# EasyEDA Pro project 无刷电调_V3.1.epro, schematic 无刷电调_V3.1

## Sheets
1 P1: Board Name: 无刷电调_V3.1; Create Date: 2025-04-09; Page Name: P1; Project Name: BLDC电调; Schematic Name: 无刷电调_V3.1; Update Date: 2025-04-09; Company: 嘉立创EDA; Page Size: A4; Version: V1.0
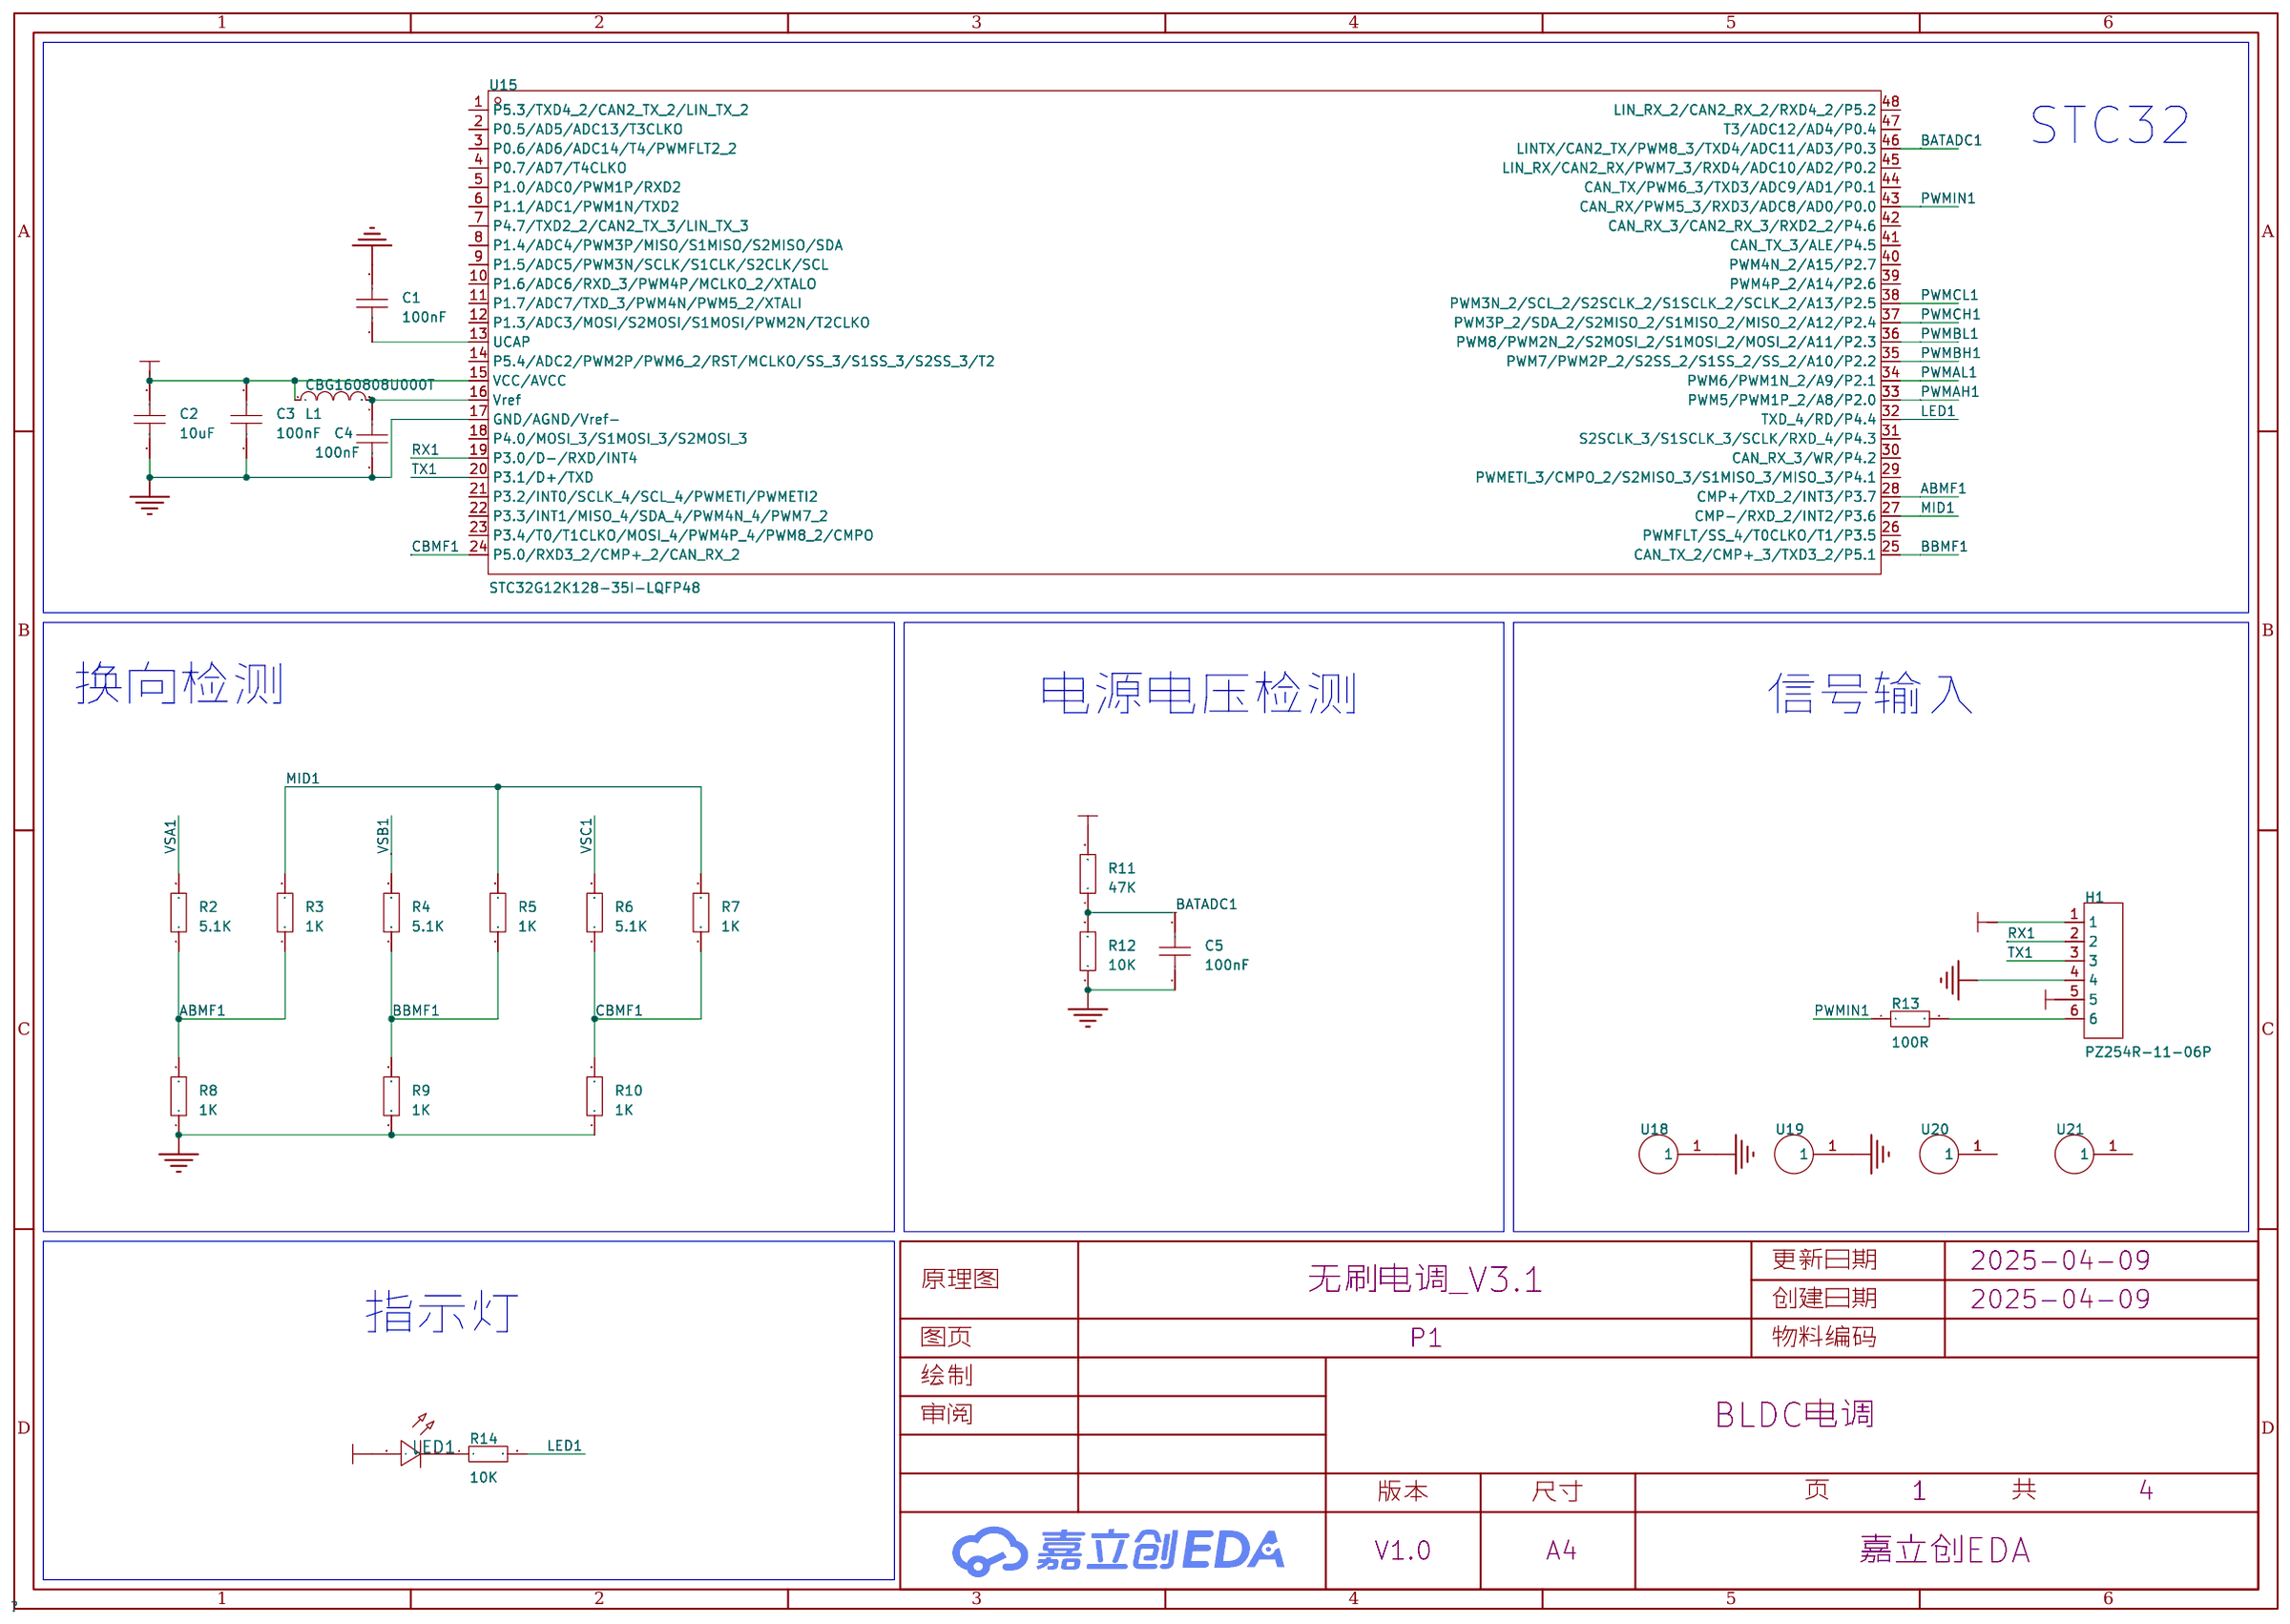
[diagram p0: P1]
2 P2: Page Name: P2
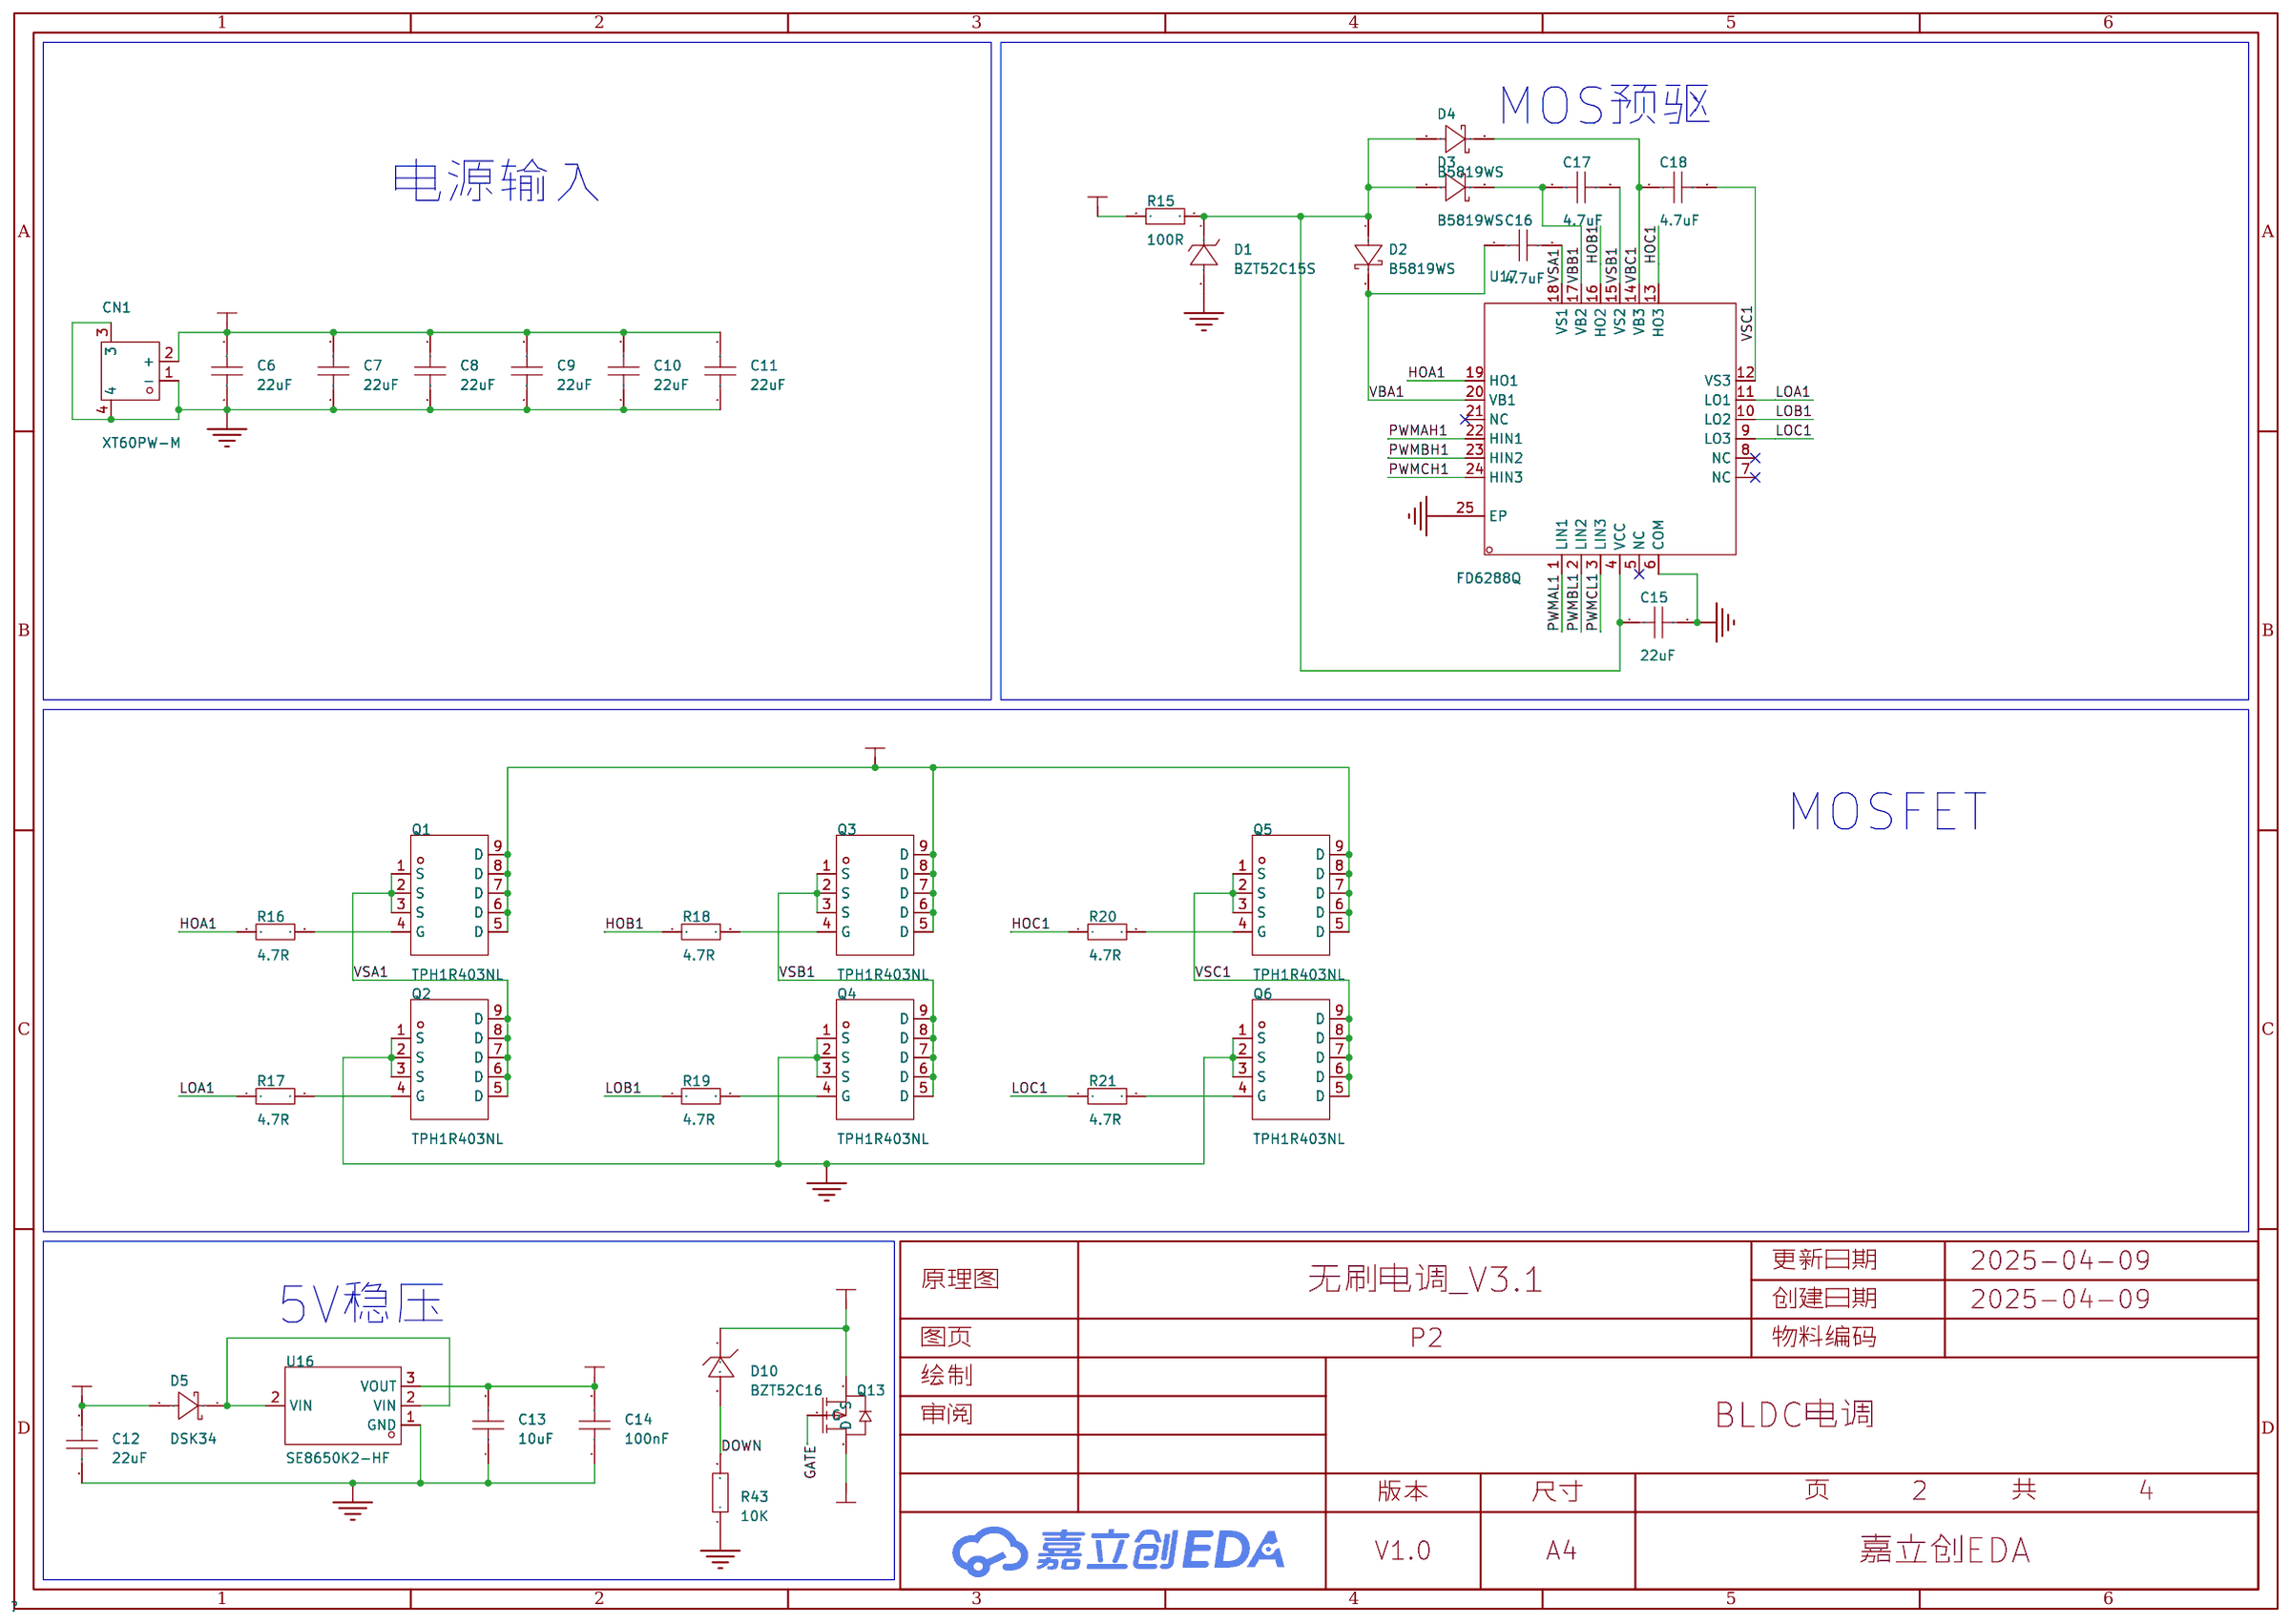
[diagram p1: P2]
3 P3: Board Name: 无刷电调_V3.0; Create Date: 2025-03-24; Page Name: P3; Schematic Name: 无刷电调_V3.0; Update Date: 2025-03-24
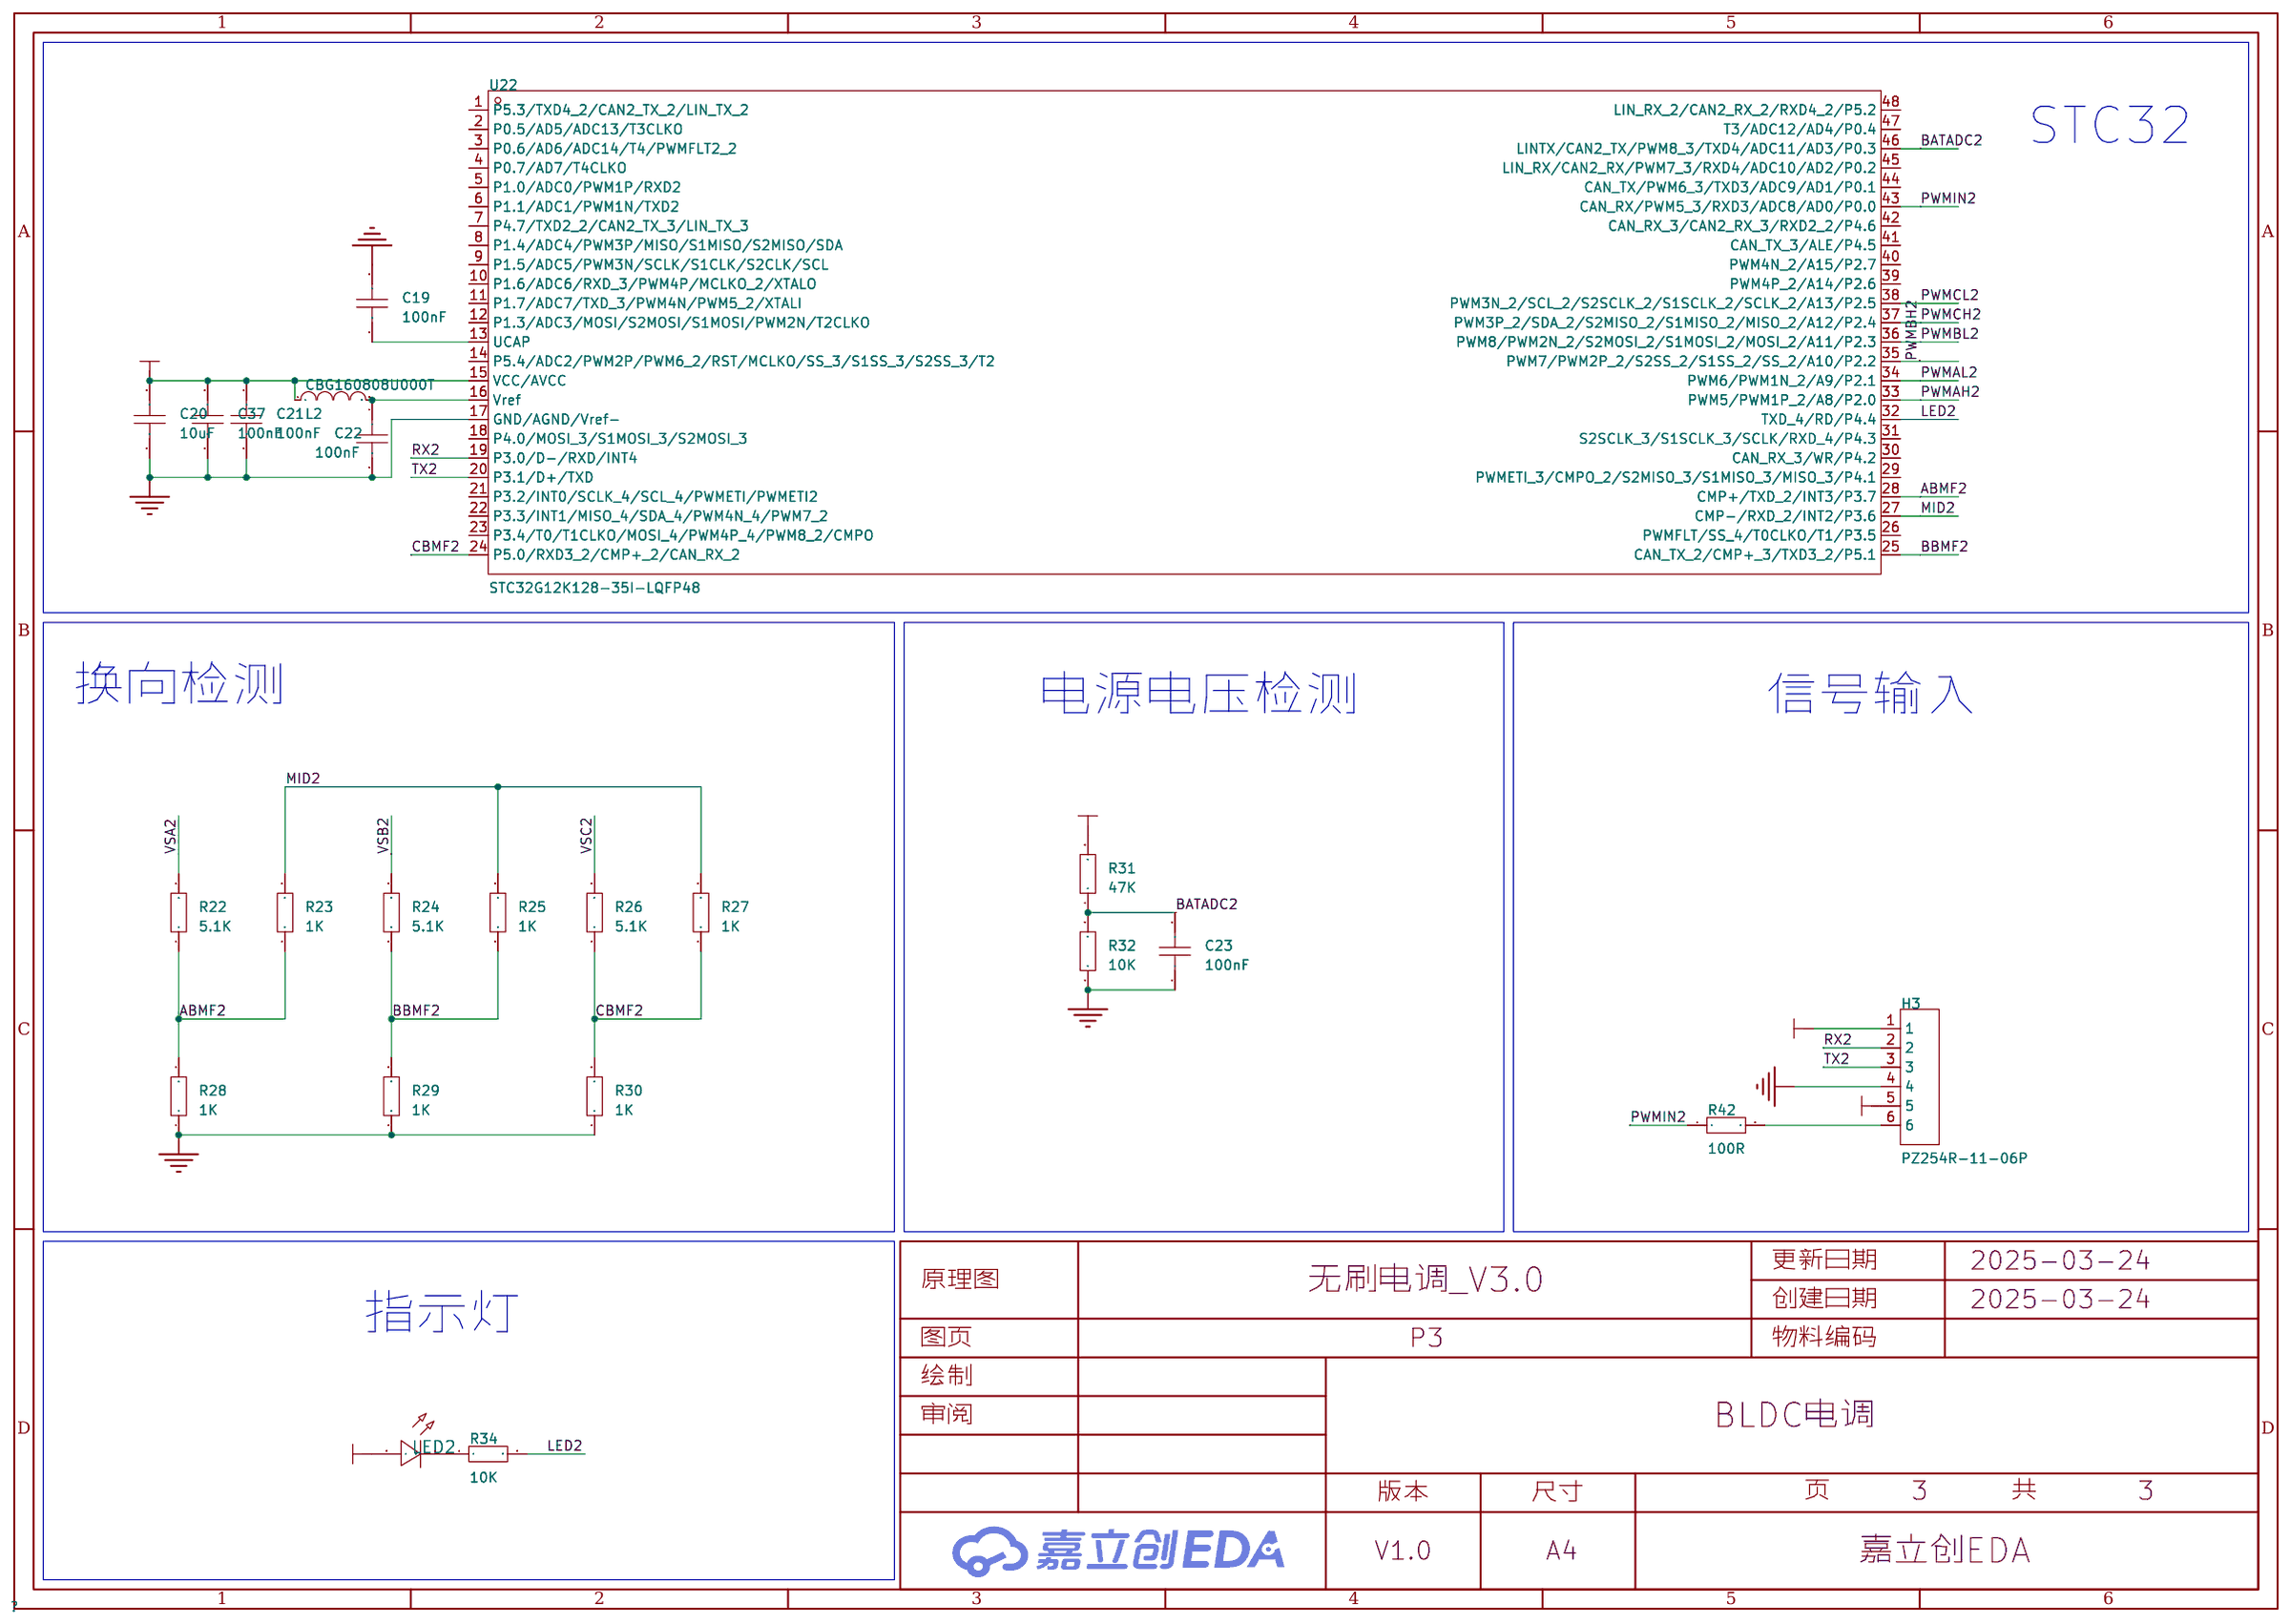
[diagram p2: P3]
4 P4: Board Name: 无刷电调_V3.0; Create Date: 2025-03-24; Page Name: P4; Schematic Name: 无刷电调_V3.0; Update Date: 2025-03-24
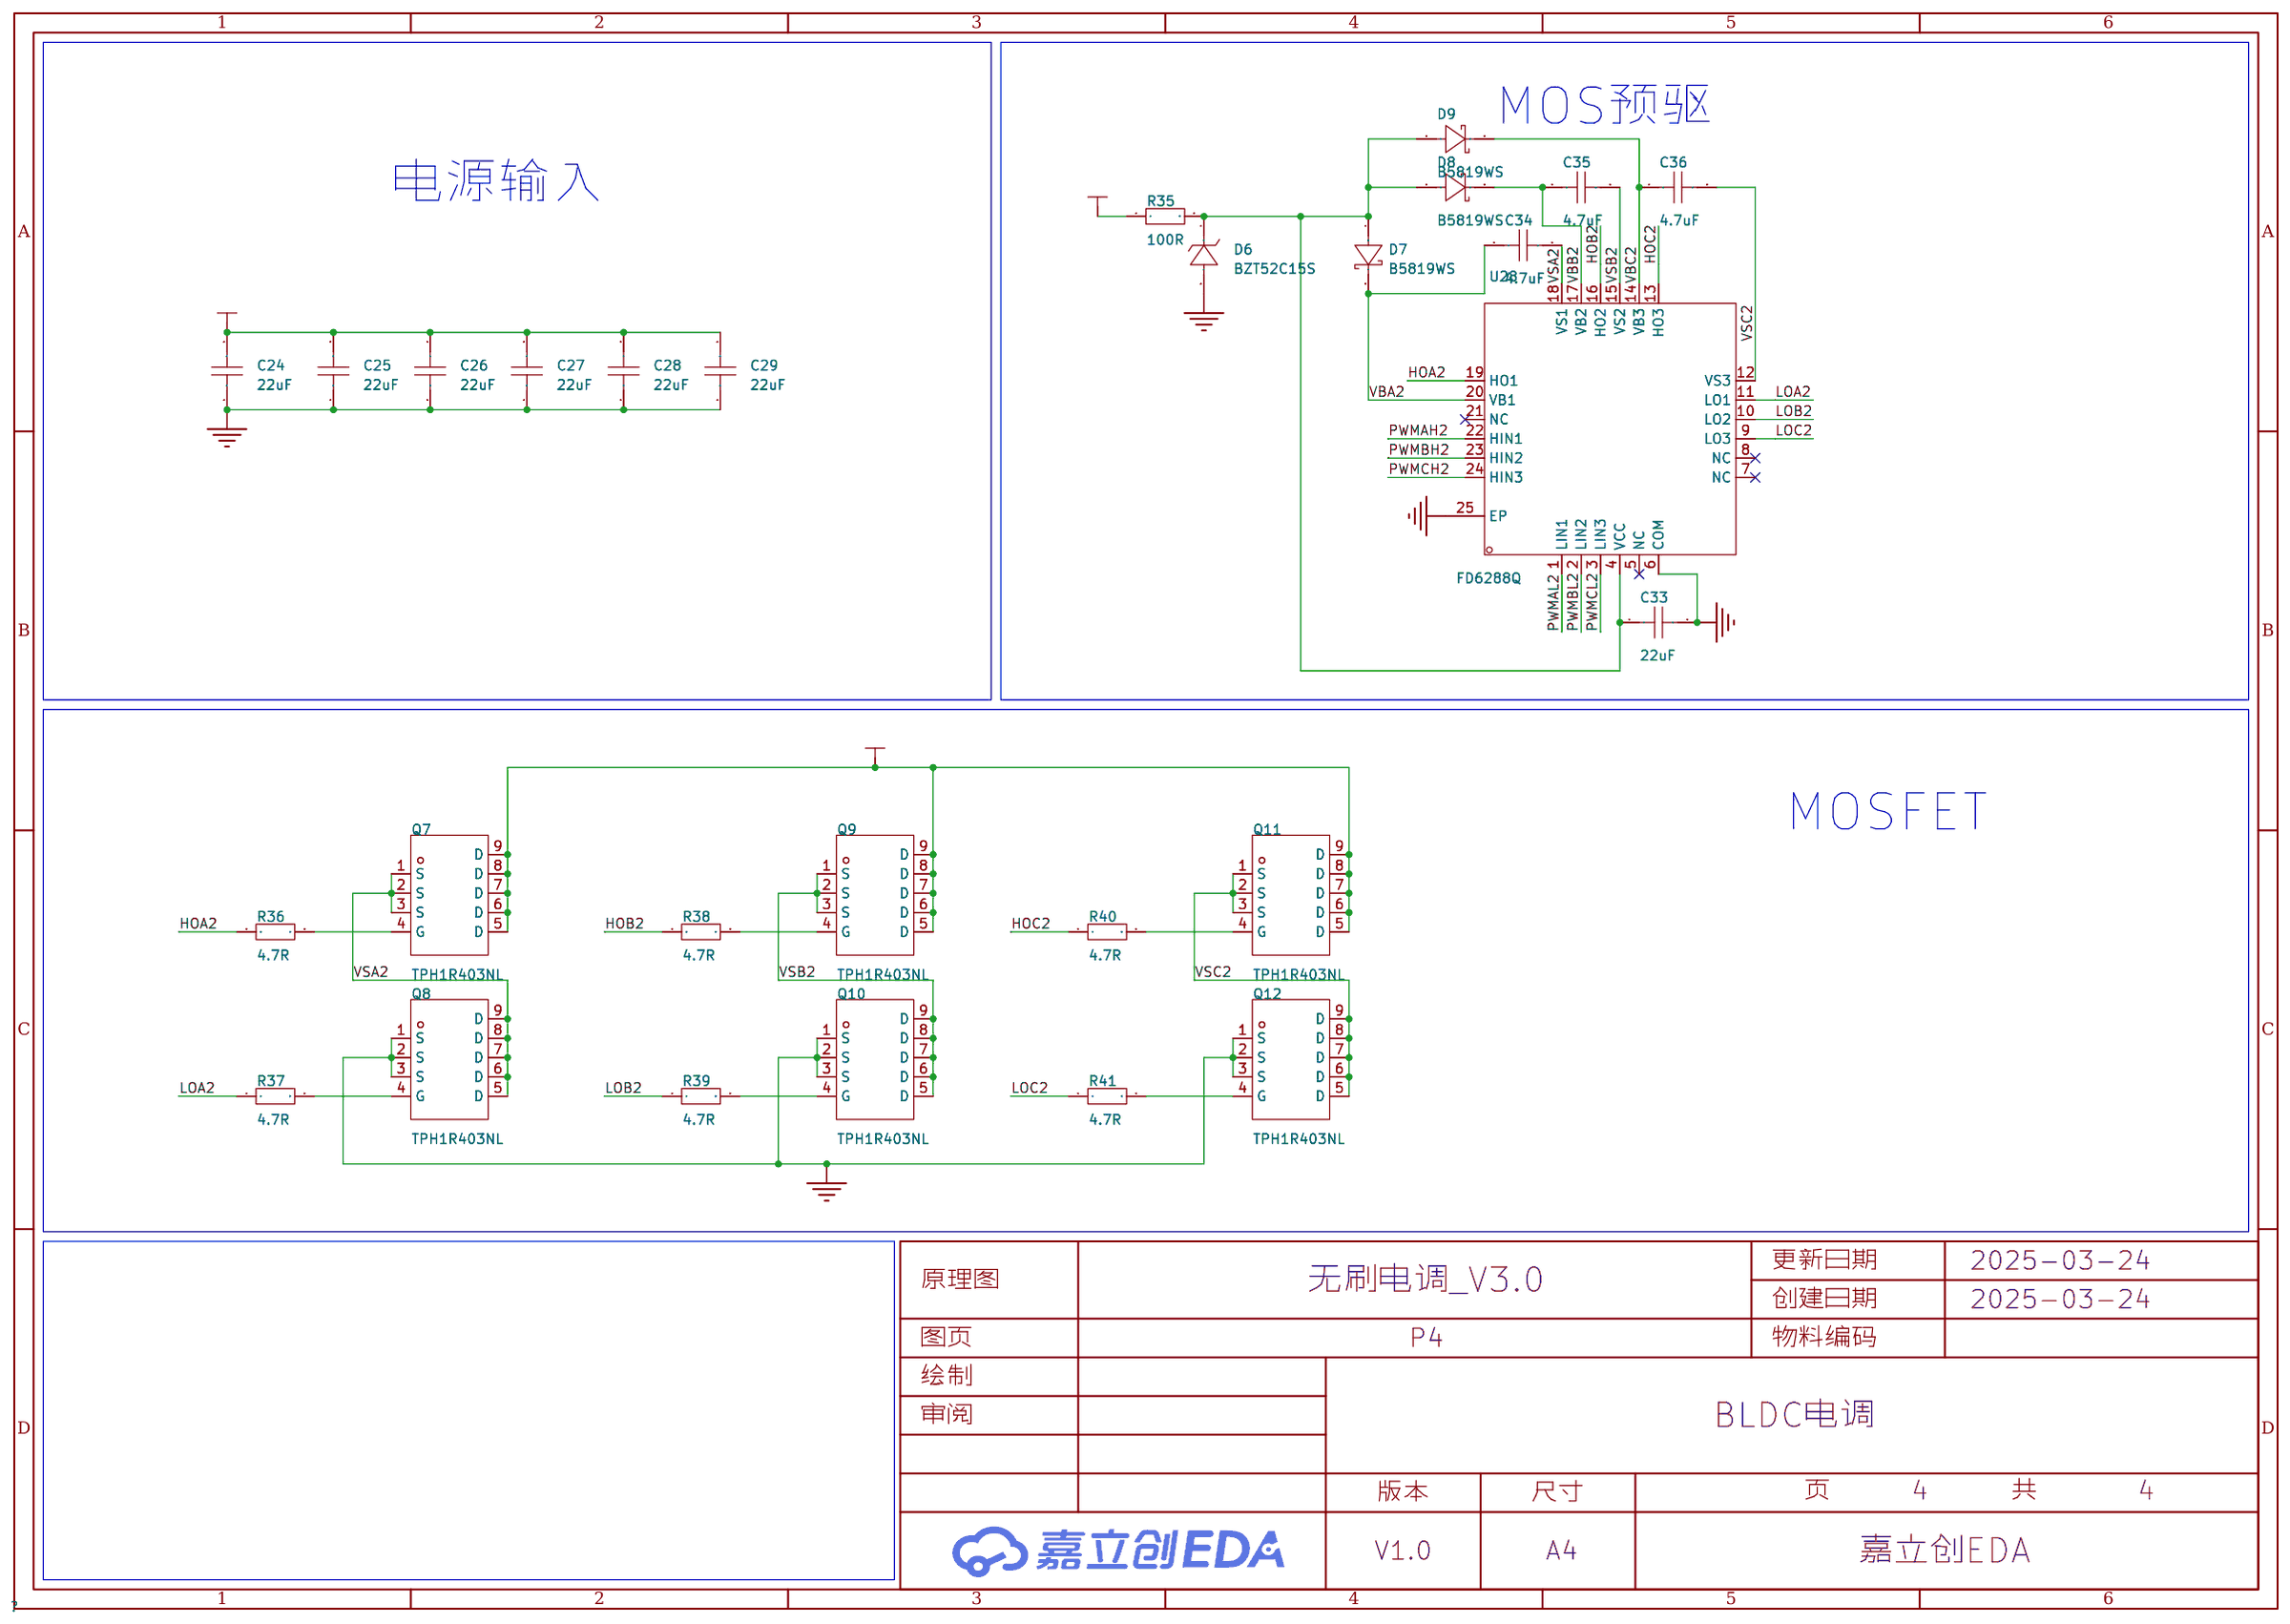
[diagram p3: P4]

## Parts
sheet P1
C1  100nF  [C0603]
C2  10uF  [C0603]
C3  100nF  [C0603]
C4  100nF  [C0603]
C5  100nF  [C0603]
H1  PZ254R-11-06P  [HDR-TH_6P-P2.54-H-M-W10.4]
L1  CBG160808U000T  [L0603]
LED1  -  [LED_0603]
R2  5.1K  [R0603]
R3  1K  [R0603]
R4  5.1K  [R0603]
R5  1K  [R0603]
R6  5.1K  [R0603]
R7  1K  [R0603]
R8  1K  [R0603]
R9  1K  [R0603]
R10  1K  [R0603]
R11  47K  [R0603]
R12  10K  [R0603]
R13  100R  [R0603]
R14  10K  [R0603]
U15  STC32G12K128-35I-LQFP48  [LQFP-48_L7.0-W7.0-P0.50-LS9.0-BL]
U18  -  [M3螺丝孔]  (no BOM)
U19  -  [M3螺丝孔]  (no BOM)
U20  -  [M3螺丝孔]  (no BOM)
U21  -  [M3螺丝孔]  (no BOM)
sheet P2
C6  22uF  [C0805]
C7  22uF  [C0805]
C8  22uF  [C0805]
C9  22uF  [C0805]
C10  22uF  [C0805]
C11  22uF  [C0805]
C12  22uF  [C0805]
C13  10uF  [C0603]
C14  100nF  [C0603]
C15  22uF  [C0805]
C16  4.7uF  [C0805]
C17  4.7uF  [C0805]
C18  4.7uF  [C0805]
CN1  XT60PW-M  [CONN-TH_XT60PW-M]
D1  BZT52C15S  [SOD-323_L1.7-W1.3-LS2.6-RD]
D2  B5819WS  [SOD-323_L1.7-W1.3-LS2.5-FD]
D3  B5819WS  [SOD-323_L1.7-W1.3-LS2.5-FD]
D4  B5819WS  [SOD-323_L1.7-W1.3-LS2.5-FD]
D5  DSK34  [SOD-123_L2.8-W1.8-LS3.7-RD]
D10  BZT52C16  [SOD-123_L2.7-W1.6-LS3.7-RD]
Q1  TPH1R403NL  [DSOP-8_L5.0-W5.0-P1.27-LS6.0-BL-EP]
Q2  TPH1R403NL  [DSOP-8_L5.0-W5.0-P1.27-LS6.0-BL-EP]
Q3  TPH1R403NL  [DSOP-8_L5.0-W5.0-P1.27-LS6.0-BL-EP]
Q4  TPH1R403NL  [DSOP-8_L5.0-W5.0-P1.27-LS6.0-BL-EP]
Q5  TPH1R403NL  [DSOP-8_L5.0-W5.0-P1.27-LS6.0-BL-EP]
Q6  TPH1R403NL  [DSOP-8_L5.0-W5.0-P1.27-LS6.0-BL-EP]
Q13  -  [AO3401A_SOT-23-3]
R15  100R  [R0603]
R16  4.7R  [R0603]
R17  4.7R  [R0603]
R18  4.7R  [R0603]
R19  4.7R  [R0603]
R20  4.7R  [R0603]
R21  4.7R  [R0603]
R43  10K  [R0603]
U16  SE8650K2-HF  [SOT-89-3_L4.5-W2.5-P1.50-LS4.2-BR]
U17  FD6288Q  [QFN-24_L4.0-W4.0-P0.50-BL-EP2.6]
sheet P3
C19  100nF  [C0603]
C20  10uF  [C0603]
C21  100nF  [C0603]
C22  100nF  [C0603]
C23  100nF  [C0603]
C37  100nF  [C0603]
H3  PZ254R-11-06P  [HDR-TH_6P-P2.54-H-M-W10.4]
L2  CBG160808U000T  [L0603]
LED2  -  [LED_0603]
R22  5.1K  [R0603]
R23  1K  [R0603]
R24  5.1K  [R0603]
R25  1K  [R0603]
R26  5.1K  [R0603]
R27  1K  [R0603]
R28  1K  [R0603]
R29  1K  [R0603]
R30  1K  [R0603]
R31  47K  [R0603]
R32  10K  [R0603]
R34  10K  [R0603]
R42  100R  [R0603]
U22  STC32G12K128-35I-LQFP48  [LQFP-48_L7.0-W7.0-P0.50-LS9.0-BL]
sheet P4
C24  22uF  [C0805]
C25  22uF  [C0805]
C26  22uF  [C0805]
C27  22uF  [C0805]
C28  22uF  [C0805]
C29  22uF  [C0805]
C33  22uF  [C0805]
C34  4.7uF  [C0805]
C35  4.7uF  [C0805]
C36  4.7uF  [C0805]
D6  BZT52C15S  [SOD-323_L1.7-W1.3-LS2.6-RD]
D7  B5819WS  [SOD-323_L1.7-W1.3-LS2.5-FD]
D8  B5819WS  [SOD-323_L1.7-W1.3-LS2.5-FD]
D9  B5819WS  [SOD-323_L1.7-W1.3-LS2.5-FD]
Q7  TPH1R403NL  [DSOP-8_L5.0-W5.0-P1.27-LS6.0-BL-EP]
Q8  TPH1R403NL  [DSOP-8_L5.0-W5.0-P1.27-LS6.0-BL-EP]
Q9  TPH1R403NL  [DSOP-8_L5.0-W5.0-P1.27-LS6.0-BL-EP]
Q10  TPH1R403NL  [DSOP-8_L5.0-W5.0-P1.27-LS6.0-BL-EP]
Q11  TPH1R403NL  [DSOP-8_L5.0-W5.0-P1.27-LS6.0-BL-EP]
Q12  TPH1R403NL  [DSOP-8_L5.0-W5.0-P1.27-LS6.0-BL-EP]
R35  100R  [R0603]
R36  4.7R  [R0603]
R37  4.7R  [R0603]
R38  4.7R  [R0603]
R39  4.7R  [R0603]
R40  4.7R  [R0603]
R41  4.7R  [R0603]
U28  FD6288Q  [QFN-24_L4.0-W4.0-P0.50-BL-EP2.6]

## Library data of the parts
C1-C5 C13 C14 C19-C23 C37 = CAP_0603: Supplier Footprint: 0603
H1 H3 = PZ254R-11-06P: 插针结构:1x6P;间距:2.54mm;行距:-;圆针/方针:方针;安装方式:弯插;排数:单排;总PIN位数:6P;额定电流:-;额定电压:-;配合针长度:6mm;塑高:2.5mm;触头材质:黄铜;触头镀层:-;工作温度:-40℃~+105℃;颜色:黑色;; LCSC Part Name: 1x6P 间距:2.54mm 方针 弯插; Supplier Part: C492414; Manufacturer: XFCN(兴飞); Supplier Footprint: 弯插,P=2.54mm; JLCPCB Part Class: Extended Part; Datasheet: https://atta.szlcsc.com/upload/public/pdf/source/20200309/C492414_188252315A8FC19F8382BF484DD4F4B8.pdf; Supplier: LCSC; Pin Structure: 1x6P; Pitch: 2.54mm; Circluar Pins/Square Pins: 方针; Mounting Type: 弯插; Number of Rows: 单排; Number of Pins: 6P; Length of Mating Pin: 6mm; Insulation Height: 2.5mm; Contact Material: 黄铜; Operating Temperature: -40℃~+105℃; Color: 黑色
L1 L2 = CBG160808U000T: 标称阻抗@测试频率:0Ω@100MHz;直流电阻(RDC):100mΩ;; LCSC Part Name: 单路 0603磁珠 阻抗0Ω@100MHz; Supplier Part: C43163; Manufacturer: FH(风华); Supplier Footprint: 0603; JLCPCB Part Class: 扩展库; Datasheet: https://atta.szlcsc.com/upload/public/pdf/source/20190129/C361667_1614D407CC98D1D3CFBD9E1F7511C14D.pdf; Supplier: LCSC; Impedance @ Frequency: 0Ω@100MHz; DC Resistance: 100mΩ; Current Rating: 800mA; Circuits: 1
LED1 LED2 = LED_0603-R: Supplier Footprint: 0603
R2-R32 R34-R43 = Res_0603: Supplier Footprint: 0603
U15 U22 = STC32G12K128-35I-LQFP48: Supplier Part: C5210760; Manufacturer: STC(宏晶); Supplier Footprint: LQFP-48(7x7); JLCPCB Part Class: 扩展库; Datasheet: https://atta.szlcsc.com/upload/public/pdf/source/20230914/AA8E7D278420EC7FE3821FDFD9AB7FC5.pdf; Supplier: LCSC
U18-U21 = M3螺丝孔
C6-C12 C15-C18 C24-C29 C33-C36 = CAP_0805: Supplier Footprint: 0805
CN1 = XT60PW-M: 类别:-;类型1:-;; LCSC Part Name: AMASS(艾迈斯)航模插头xt60连接器150公母对接pw锂电池公头 板插卧式XT60PW-M; Supplier Part: C98732; Manufacturer: AMASS(艾迈斯); JLCPCB Part Class: Extended Part; Datasheet: https://atta.szlcsc.com/upload/public/pdf/source/20240118/44A3DCFF53BE25DC65378AFFB21277A4.pdf; Supplier: LCSC; Brand: 艾迈斯; Type: 卧式插头; Colour: 黄色; InterfaceType: 公头
D1 D6 = BZT52C15S_C19077448: 二极管配置:独立式;稳压值(标称值):15V;稳压值(范围):13.8V~15.6V;功率(Pd):200mW;; Supplier Part: C19077448; Manufacturer: 宏迦橙; Supplier Footprint: SOD-323; JLCPCB Part Class: 扩展库; Datasheet: https://atta.szlcsc.com/upload/public/pdf/source/20231117/06CD1C2A69B3FFC97FEAE4263E1B2FE9.pdf; Supplier: LCSC; Diode Configuration: 独立式; Zener Voltage (Nom): 15V; Reverse Leakage Current (Ir): 100nA@10.5V; Zener Voltage (Range): 13.8V~15.6V; Power Dissipation: 200mW; Zener Impedance (Zzt): 30Ω
D2-D4 D7-D9 = B5819WS_C7420331: 二极管配置:独立式;直流反向耐压(Vr):40V;平均整流电流(Io):1A;正向压降(Vf):600mV@1.0A;; LCSC Part Name: 电压:40V 电流:1A; Supplier Part: C7420331; Manufacturer: 宏迦橙; Supplier Footprint: SOD-323; JLCPCB Part Class: 扩展库; Datasheet: https://atta.szlcsc.com/upload/public/pdf/source/20230828/03CA0F4F90DAE368A7153B7B5E4D0651.pdf; Supplier: LCSC; Diode Configuration: 独立式; Reverse Voltage (Vr): 40V; Average Rectified Current (Io): 1A; Forward Voltage (Vf@If): 600mV@1.0A; Reverse Leakage Current (Ir): 1mA@40V; Peak forward surge current: 10A
D5 = DSK34: 二极管配置:-;正向压降(Vf):550mV@3A;直流反向耐压(Vr):40V;整流电流:3A;; LCSC Part Name: 电压:40V 电流:3A; Supplier Part: C908230; Manufacturer: FUXINSEMI(富芯森美); Supplier Footprint: SOD-123; JLCPCB Part Class: 扩展库; Datasheet: https://atta.szlcsc.com/upload/public/pdf/source/20201027/C908230_5B73A4E0F076D2A690D7C134AB43D23C.pdf; Supplier: LCSC; Forward Voltage (Vf@If): 550mV@3A; Reverse Voltage (Vr): 40V; Rectified Current: 3A; Reverse Leakage Current (Ir): 500uA
D10 = BZT52C16_C266570: 二极管配置:独立式;稳压值(标称值):16V;稳压值(范围):15.3V~17.1V;功率:500mW;精度:-;; Supplier Part: C266570; Manufacturer: BORN(伯恩半导体); Supplier Footprint: SOD-123; JLCPCB Part Class: 扩展库; Datasheet: https://atta.szlcsc.com/upload/public/pdf/source/20180820/C271262_D2D0F24DD5A81EAE2A6B8B493A94E64A.pdf; Supplier: LCSC; Diode Configuration: 独立式; Zener Voltage (Nom): 16V; Reverse Leakage Current (Ir): 100nA@11.2V; Zener Voltage (Range): 15.3V~17.1V; Power Dissipation: 500mW; Zener Impedance (Zzt): 40Ω
Q1-Q12 = TPH1R403NL_C83440: 类型:N沟道;漏源电压(Vdss):30V;连续漏极电流(Id):150A;功率(Pd):64W;导通电阻(RDS(on)@Vgs,Id):1.4mΩ@10V,30A;阈值电压(Vgs(th)@Id):2.3V@500uA;; LCSC Part Name: N沟道 30V 150A; Supplier Part: C83440; Manufacturer: TOSHIBA(东芝); Supplier Footprint: DSOP-8-EP-5.0mm; JLCPCB Part Class: 扩展库; Datasheet: https://atta.szlcsc.com/upload/public/pdf/source/20170908/C83440_1504870121708958077.pdf; Supplier: LCSC; Type: N沟道; Drain Source Voltage (Vdss): 30V; Continuous Drain Current (Id): 150A; Power Dissipation (Pd): 64W; Drain Source On Resistance (RDS(on)@Vgs,Id): 1.4mΩ@10V,30A; Gate Threshold Voltage (Vgs(th)@Id): 2.3V@500uA
Q13 = AO3401A_P: Supplier Footprint: SOT-23-3L; Supplier Part: C15127
U16 = SE8650K2-HF: 输出类型:固定;最大输入电压:80V;输出电压:5V;最大输出电流:-;电源纹波抑制比(PSRR):85dB;输出极性:正极;; LCSC Part Name: 输入80V 输出5V; Supplier Part: C496616; Manufacturer: SEAWARD(思旺); Supplier Footprint: SOT-89-3; JLCPCB Part Class: 扩展库; Datasheet: https://atta.szlcsc.com/upload/public/pdf/source/20231204/E5912244F6D9E24D718D6BDA01187AC7.pdf; Supplier: LCSC; Output Type: 固定; Maximum Input Voltage: 80V; Output Voltage: 5V; Power Supply Rejection Ratio (PSRR): 85dB; standby current: 2uA; Output Polarity: 正极; Number of Outputs: 1
U17 U28 = FD6288Q: Supplier Part: C328453; Manufacturer: Fortior Tech(峰岹); Supplier Footprint: QFN-24-EP(4x4); JLCPCB Part Class: 扩展库; Datasheet: https://atta.szlcsc.com/upload/public/pdf/source/20241101/0E2856EB301EAFFED732065FB088D773.pdf; Supplier: LCSC

## Nets
GND: C1.2 C2.1 C3.1 C4.2 C5.1 C6.1 C7.1 C8.1 C9.1 C10.1 C11.1 C12.1 C13.1 C14.1 C15.2 C19.2 C20.1 C21.1 C22.2 C23.1 C24.1 C25.1 C26.1 C27.1 C28.1 C29.1 C33.2 C37.1 CN1.1(-) CN1.3 CN1.4 D1.2(A) D6.2(A) H1.4 H3.4 Q2.1(S) Q2.2(S) Q2.3(S) Q4.1(S) Q4.2(S) Q4.3(S) Q6.1(S) Q6.2(S) Q6.3(S) Q8.1(S) Q8.2(S) Q8.3(S) Q10.1(S) Q10.2(S) Q10.3(S) Q12.1(S) Q12.2(S) Q12.3(S) R8.1 R9.1 R10.1 R12.1 R28.1 R29.1 R30.1 R32.1 R43.1 U15.17(GND/AGND/Vref-) U16.1(GND) U17.6(COM) U17.25(EP) U18.1 U19.1 U22.17(GND/AGND/Vref-) U28.6(COM) U28.25(EP)
VBAT: C6.2 C7.2 C8.2 C9.2 C10.2 C11.2 C24.2 C25.2 C26.2 C27.2 C28.2 C29.2 CN1.2(+) D10.1 Q1.5(D) Q1.6(D) Q1.7(D) Q1.8(D) Q1.9(D) Q3.5(D) Q3.6(D) Q3.7(D) Q3.8(D) Q3.9(D) Q5.5(D) Q5.6(D) Q5.7(D) Q5.8(D) Q5.9(D) Q7.5(D) Q7.6(D) Q7.7(D) Q7.8(D) Q7.9(D) Q9.5(D) Q9.6(D) Q9.7(D) Q9.8(D) Q9.9(D) Q11.5(D) Q11.6(D) Q11.7(D) Q11.8(D) Q11.9(D) Q13.2(S) R11.2 R15.1 R31.2 R35.1
VCC5V: C2.2 C3.2 C13.2 C14.2 C20.2 C21.2 C37.2 H1.1 H1.5 H3.1 H3.5 L1.1 L2.1 LED1.2(A) LED2.2(A) U15.15(VCC/AVCC) U16.3(VOUT) U22.15(VCC/AVCC)
VCC12V: C12.2 D5.2(A) Q13.3(D)
ABMF1: R2.1 R3.1 R8.2 U15.28(CMP+/TXD_2/INT3/P3.7)
ABMF2: R22.1 R23.1 R28.2 U22.28(CMP+/TXD_2/INT3/P3.7)
BATADC1: C5.2 R11.1 R12.2 U15.46(LINTX/CAN2_TX/PWM8_3/TXD4/ADC11/AD3/P0.3)
BATADC2: C23.2 R31.1 R32.2 U22.46(LINTX/CAN2_TX/PWM8_3/TXD4/ADC11/AD3/P0.3)
BBMF1: R4.1 R5.1 R9.2 U15.25(CAN_TX_2/CMP+_3/TXD3_2/P5.1)
BBMF2: R24.1 R25.1 R29.2 U22.25(CAN_TX_2/CMP+_3/TXD3_2/P5.1)
CBMF1: R6.1 R7.1 R10.2 U15.24(P5.0/RXD3_2/CMP+_2/CAN_RX_2)
CBMF2: R26.1 R27.1 R30.2 U22.24(P5.0/RXD3_2/CMP+_2/CAN_RX_2)
DOWN: D10.2 R43.2
GATE: Q13.1(G)
HOA1: R16.1 U17.19(HO1)
HOA2: R36.1 U28.19(HO1)
HOB1: R18.1 U17.16(HO2)
HOB2: R38.1 U28.16(HO2)
HOC1: R20.1 U17.13(HO3)
HOC2: R40.1 U28.13(HO3)
LED1: R14.2 U15.32(TXD_4/RD/P4.4)
LED2: R34.2 U22.32(TXD_4/RD/P4.4)
LOA1: R17.1 U17.11(LO1)
LOA2: R37.1 U28.11(LO1)
LOB1: R19.1 U17.10(LO2)
LOB2: R39.1 U28.10(LO2)
LOC1: R21.1 U17.9(LO3)
LOC2: R41.1 U28.9(LO3)
MID1: R3.2 R5.2 R7.2 U15.27(CMP-/RXD_2/INT2/P3.6)
MID2: R23.2 R25.2 R27.2 U22.27(CMP-/RXD_2/INT2/P3.6)
PWMAH1: U15.33(PWM5/PWM1P_2/A8/P2.0) U17.22(HIN1)
PWMAH2: U22.33(PWM5/PWM1P_2/A8/P2.0) U28.22(HIN1)
PWMAL1: U15.34(PWM6/PWM1N_2/A9/P2.1) U17.1(LIN1)
PWMAL2: U22.34(PWM6/PWM1N_2/A9/P2.1) U28.1(LIN1)
PWMBH1: U15.35(PWM7/PWM2P_2/S2SS_2/S1SS_2/SS_2/A10/P2.2) U17.23(HIN2)
PWMBH2: U22.35(PWM7/PWM2P_2/S2SS_2/S1SS_2/SS_2/A10/P2.2) U28.23(HIN2)
PWMBL1: U15.36(PWM8/PWM2N_2/S2MOSI_2/S1MOSI_2/MOSI_2/A11/P2.3) U17.2(LIN2)
PWMBL2: U22.36(PWM8/PWM2N_2/S2MOSI_2/S1MOSI_2/MOSI_2/A11/P2.3) U28.2(LIN2)
PWMCH1: U15.37(PWM3P_2/SDA_2/S2MISO_2/S1MISO_2/MISO_2/A12/P2.4) U17.24(HIN3)
PWMCH2: U22.37(PWM3P_2/SDA_2/S2MISO_2/S1MISO_2/MISO_2/A12/P2.4) U28.24(HIN3)
PWMCL1: U15.38(PWM3N_2/SCL_2/S2SCLK_2/S1SCLK_2/SCLK_2/A13/P2.5) U17.3(LIN3)
PWMCL2: U22.38(PWM3N_2/SCL_2/S2SCLK_2/S1SCLK_2/SCLK_2/A13/P2.5) U28.3(LIN3)
PWMIN1: R13.1 U15.43(CAN_RX/PWM5_3/RXD3/ADC8/AD0/P0.0)
PWMIN2: R42.1 U22.43(CAN_RX/PWM5_3/RXD3/ADC8/AD0/P0.0)
RX1: H1.2 U15.19(P3.0/D-/RXD/INT4)
RX2: H3.2 U22.19(P3.0/D-/RXD/INT4)
TX1: H1.3 U15.20(P3.1/D+/TXD)
TX2: H3.3 U22.20(P3.1/D+/TXD)
VBA1: C16.1 D2.2(K) U17.20(VB1)
VBA2: C34.1 D7.2(K) U28.20(VB1)
VBB1: C17.1 D3.2(K) U17.17(VB2)
VBB2: C35.1 D8.2(K) U28.17(VB2)
VBC1: C18.1 D4.2(K) U17.14(VB3)
VBC2: C36.1 D9.2(K) U28.14(VB3)
VSA1: C16.2 Q1.1(S) Q1.2(S) Q1.3(S) Q2.5(D) Q2.6(D) Q2.7(D) Q2.8(D) Q2.9(D) R2.2 U17.18(VS1)
VSA2: C34.2 Q7.1(S) Q7.2(S) Q7.3(S) Q8.5(D) Q8.6(D) Q8.7(D) Q8.8(D) Q8.9(D) R22.2 U28.18(VS1)
VSB1: C17.2 Q3.1(S) Q3.2(S) Q3.3(S) Q4.5(D) Q4.6(D) Q4.7(D) Q4.8(D) Q4.9(D) R4.2 U17.15(VS2)
VSB2: C35.2 Q9.1(S) Q9.2(S) Q9.3(S) Q10.5(D) Q10.6(D) Q10.7(D) Q10.8(D) Q10.9(D) R24.2 U28.15(VS2)
VSC1: C18.2 Q5.1(S) Q5.2(S) Q5.3(S) Q6.5(D) Q6.6(D) Q6.7(D) Q6.8(D) Q6.9(D) R6.2 U17.12(VS3)
VSC2: C36.2 Q11.1(S) Q11.2(S) Q11.3(S) Q12.5(D) Q12.6(D) Q12.7(D) Q12.8(D) Q12.9(D) R26.2 U28.12(VS3)
$1N2415: C4.1 L1.2 U15.16(Vref)
$1N2565: C1.1 U15.13(UCAP)
$1N3950: LED1.1(C) R14.1
$1N4630: H1.6 R13.2
$2N2044: D5.1(K) U16.2(VIN)
$2N3820: Q1.4(G) R16.2
$2N3824: Q2.4(G) R17.2
$2N3829: Q3.4(G) R18.2
$2N3834: Q4.4(G) R19.2
$2N3839: Q5.4(G) R20.2
$2N3844: Q6.4(G) R21.2
$2N4700: C15.1 D1.1(K) D2.1(A) D3.1(A) D4.1(A) R15.2 U17.4(VCC)
$3N917: C22.1 L2.2 U22.16(Vref)
$3N919: C19.1 U22.13(UCAP)
$3N974: LED2.1(C) R34.1
$3N1144: H3.6 R42.2
$4N1459: Q7.4(G) R36.2
$4N1460: Q8.4(G) R37.2
$4N1461: Q9.4(G) R38.2
$4N1462: Q10.4(G) R39.2
$4N1463: Q11.4(G) R40.2
$4N1464: Q12.4(G) R41.2
$4N1481: C33.1 D6.1(K) D7.1(A) D8.1(A) D9.1(A) R35.2 U28.4(VCC)

Not connected (* = marked no-connect by the designer): U15 1(P5.3/TXD4_2/CAN2_TX_2/LIN_TX_2) 2(P0.5/AD5/ADC13/T3CLKO) 3(P0.6/AD6/ADC14/T4/PWMFLT2_2) 4(P0.7/AD7/T4CLKO) 5(P1.0/ADC0/PWM1P/RXD2) 6(P1.1/ADC1/PWM1N/TXD2) 7(P4.7/TXD2_2/CAN2_TX_3/LIN_TX_3) 8(P1.4/ADC4/PWM3P/MISO/S1MISO/S2MISO/SDA) 9(P1.5/ADC5/PWM3N/SCLK/S1CLK/S2CLK/SCL) 10(P1.6/ADC6/RXD_3/PWM4P/MCLKO_2/XTALO) 11(P1.7/ADC7/TXD_3/PWM4N/PWM5_2/XTALI) 12(P1.3/ADC3/MOSI/S2MOSI/S1MOSI/PWM2N/T2CLKO) 14(P5.4/ADC2/PWM2P/PWM6_2/RST/MCLKO/SS_3/S1SS_3/S2SS_3/T2) 18(P4.0/MOSI_3/S1MOSI_3/S2MOSI_3) 21(P3.2/INT0/SCLK_4/SCL_4/PWMETI/PWMETI2) 22(P3.3/INT1/MISO_4/SDA_4/PWM4N_4/PWM7_2) 23(P3.4/T0/T1CLKO/MOSI_4/PWM4P_4/PWM8_2/CMPO) 26(PWMFLT/SS_4/T0CLKO/T1/P3.5) 29(PWMETI_3/CMPO_2/S2MISO_3/S1MISO_3/MISO_3/P4.1) 30(CAN_RX_3/WR/P4.2) 31(S2SCLK_3/S1SCLK_3/SCLK/RXD_4/P4.3) 39(PWM4P_2/A14/P2.6) 40(PWM4N_2/A15/P2.7) 41(CAN_TX_3/ALE/P4.5) 42(CAN_RX_3/CAN2_RX_3/RXD2_2/P4.6) 44(CAN_TX/PWM6_3/TXD3/ADC9/AD1/P0.1) 45(LIN_RX/CAN2_RX/PWM7_3/RXD4/ADC10/AD2/P0.2) 47(T3/ADC12/AD4/P0.4) 48(LIN_RX_2/CAN2_RX_2/RXD4_2/P5.2); U17 5(NC)* 7(NC)* 8(NC)* 21(NC)*; U20 1; U21 1; U22 1(P5.3/TXD4_2/CAN2_TX_2/LIN_TX_2) 2(P0.5/AD5/ADC13/T3CLKO) 3(P0.6/AD6/ADC14/T4/PWMFLT2_2) 4(P0.7/AD7/T4CLKO) 5(P1.0/ADC0/PWM1P/RXD2) 6(P1.1/ADC1/PWM1N/TXD2) 7(P4.7/TXD2_2/CAN2_TX_3/LIN_TX_3) 8(P1.4/ADC4/PWM3P/MISO/S1MISO/S2MISO/SDA) 9(P1.5/ADC5/PWM3N/SCLK/S1CLK/S2CLK/SCL) 10(P1.6/ADC6/RXD_3/PWM4P/MCLKO_2/XTALO) 11(P1.7/ADC7/TXD_3/PWM4N/PWM5_2/XTALI) 12(P1.3/ADC3/MOSI/S2MOSI/S1MOSI/PWM2N/T2CLKO) 14(P5.4/ADC2/PWM2P/PWM6_2/RST/MCLKO/SS_3/S1SS_3/S2SS_3/T2) 18(P4.0/MOSI_3/S1MOSI_3/S2MOSI_3) 21(P3.2/INT0/SCLK_4/SCL_4/PWMETI/PWMETI2) 22(P3.3/INT1/MISO_4/SDA_4/PWM4N_4/PWM7_2) 23(P3.4/T0/T1CLKO/MOSI_4/PWM4P_4/PWM8_2/CMPO) 26(PWMFLT/SS_4/T0CLKO/T1/P3.5) 29(PWMETI_3/CMPO_2/S2MISO_3/S1MISO_3/MISO_3/P4.1) 30(CAN_RX_3/WR/P4.2) 31(S2SCLK_3/S1SCLK_3/SCLK/RXD_4/P4.3) 39(PWM4P_2/A14/P2.6) 40(PWM4N_2/A15/P2.7) 41(CAN_TX_3/ALE/P4.5) 42(CAN_RX_3/CAN2_RX_3/RXD2_2/P4.6) 44(CAN_TX/PWM6_3/TXD3/ADC9/AD1/P0.1) 45(LIN_RX/CAN2_RX/PWM7_3/RXD4/ADC10/AD2/P0.2) 47(T3/ADC12/AD4/P0.4) 48(LIN_RX_2/CAN2_RX_2/RXD4_2/P5.2); U28 5(NC)* 7(NC)* 8(NC)* 21(NC)*

## Notes on the sheets
sheet 1
- STC32
- 换向检测
- 电源电压检测
- 信号输入
- 指示灯
sheet 2
- MOS预驱
- 电源输入
- MOSFET
- 5V稳压
sheet 3
- STC32
- 换向检测
- 电源电压检测
- 信号输入
- 指示灯
sheet 4
- MOS预驱
- 电源输入
- MOSFET
